# EAGLE design SpineAlignPCB (1) (EAGLE 9.7.0)
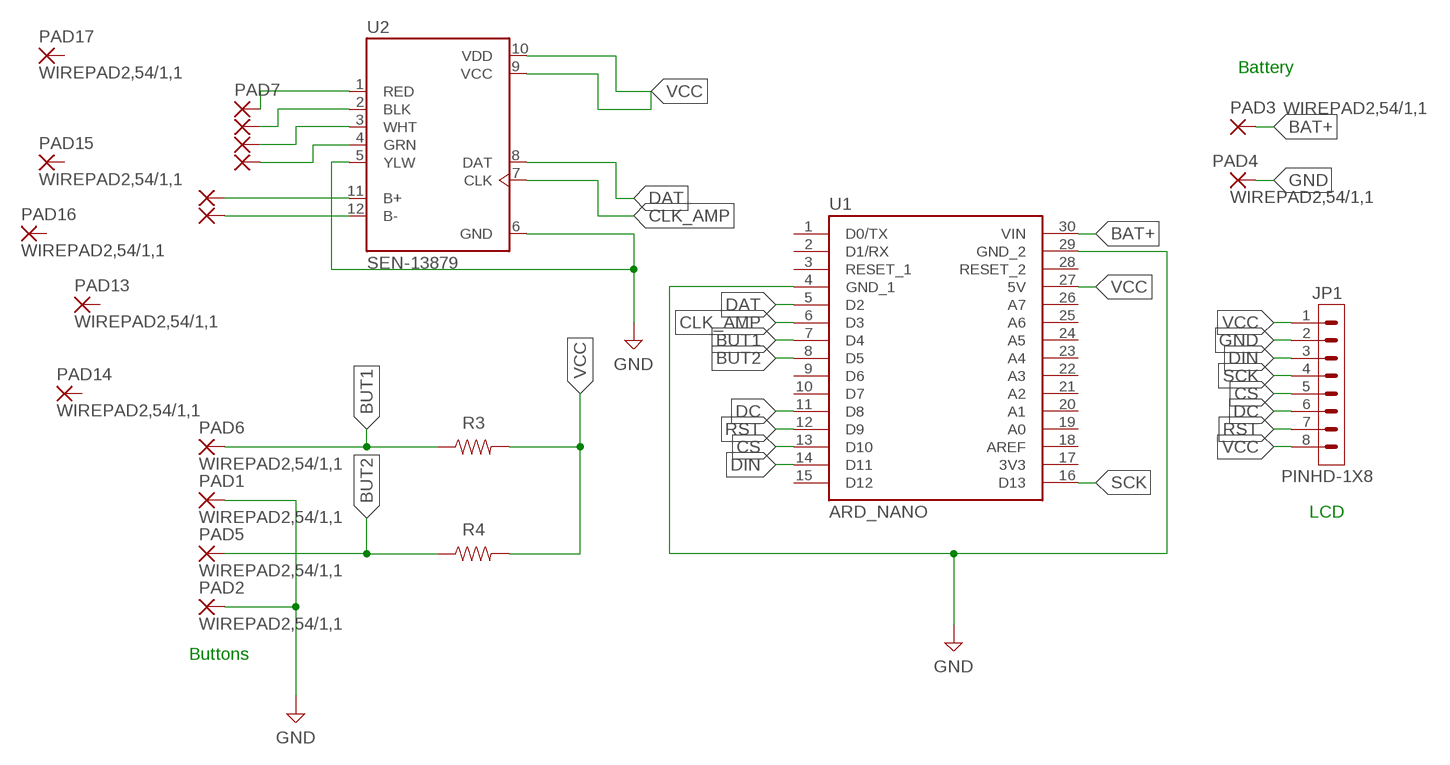
[diagram p0: schematic, sheet 1]

## Parts
JP1  PINHD-1X8  [1X08]
PAD1  WIREPAD2,54/1,1  [2,54/1,1]
PAD2  WIREPAD2,54/1,1  [2,54/1,1]
PAD3  WIREPAD2,54/1,1  [2,54/1,1]
PAD4  WIREPAD2,54/1,1  [2,54/1,1]
PAD5  WIREPAD2,54/1,1  [2,54/1,1]
PAD6  WIREPAD2,54/1,1  [2,54/1,1]
PAD7  WIREPAD2,54/1,1  [2,54/1,1]
PAD8  WIREPAD2,54/1,1  [2,54/1,1]
PAD9  WIREPAD2,54/1,1  [2,54/1,1]
PAD10  WIREPAD2,54/1,1  [2,54/1,1]
PAD11  WIREPAD2,54/1,1  [2,54/1,1]
PAD12  WIREPAD2,54/1,1  [2,54/1,1]
PAD13  WIREPAD2,54/1,1  [2,54/1,1]
PAD14  WIREPAD2,54/1,1  [2,54/1,1]
PAD15  WIREPAD2,54/1,1  [2,54/1,1]
PAD16  WIREPAD2,54/1,1  [2,54/1,1]
PAD17  WIREPAD2,54/1,1  [2,54/1,1]
R3  R-US_AXIAL-11.7MM-PITCH  [RESAD1176W63L850D250B]
R4  R-US_AXIAL-11.7MM-PITCH  [RESAD1176W63L850D250B]
U1  ARD_NANO  [MODULE_A000005]
U2  SEN-13879  [SPARKFUN_SEN-13879]

## Nets
BAT+: PAD3.1(P) U1.30(VIN)
BUT1: PAD6.1(P) R3.1 U1.7(D4)
BUT2: PAD5.1(P) R4.1 U1.8(D5)
CLK_AMP: U1.6(D3) U2.7(CLK)
CS: JP1.5 U1.13(D10)
DAT: U1.5(D2) U2.8(DAT)
DC: JP1.6 U1.11(D8)
DIN: JP1.3 U1.14(D11)
GND: JP1.2 PAD1.1(P) PAD2.1(P) PAD4.1(P) U1.4(GND_1) U1.29(GND_2) U2.5(YLW) U2.6(GND)
N$1: PAD7.1(P) U2.1(RED)
N$2: PAD8.1(P) U2.2(BLK)
N$3: PAD9.1(P) U2.3(WHT)
N$4: PAD10.1(P) U2.4(GRN)
N$5: PAD11.1(P) U2.11(B+)
N$6: PAD12.1(P) U2.12(B-)
RST: JP1.7 U1.12(D9)
SCK: JP1.4 U1.16(D13)
VCC: JP1.1 JP1.8 R3.2 R4.2 U1.27(5V) U2.9(VCC) U2.10(VDD)
Unconnected: PAD13.1(P) PAD14.1(P) PAD15.1(P) PAD16.1(P) PAD17.1(P) U1.1(D0/TX) U1.2(D1/RX) U1.3(RESET_1) U1.9(D6) U1.10(D7) U1.15(D12) U1.18(AREF) U1.19(A0) U1.20(A1) U1.21(A2) U1.22(A3) U1.23(A4) U1.24(A5) U1.25(A6) U1.26(A7) U1.28(RESET_2)

## Notes on the sheet
- Battery
- LCD
- Buttons

## Power pins joined to a net without a drawn wire
3V3: U1.17(3V3)

## Library data of the parts
JP1 = Connector:PINHD-1X8: Pin Header; CATEGORY: Connectors; DESCRIPTION: Header-Straight-8 Position; PACKAGE_TYPE: Through Hole; PITCH: 0.100" (2.54mm); SUBCATEGORY: Headers; TYPE: Male Pins
PAD1-PAD17 = wirepad:WIREPAD: Wire PAD connect wire on PCB
R3 R4 = Resistor:R-US: Resistor Fixed - ANSI; CATEGORY: Resistors; DESCRIPTION: Axial Resistor 11.76 mm pitch 8.5 mm body length 2.5 mm body diameter; PACKAGE_SIZE: AXIAL; PACKAGE_TYPE: THT
U1 = ARDUINO NANO:ARD_NANO: CLOCK SAW OSCILLATOR SEAM7050 T&; MANUFACTURER: Arduino; MAXIMUM_PACKAGE_HEIGHT: N/A; PARTREV: 23/03/2020; STANDARD: Manufacturer Recommendations
U2 = SEN-13879:SEN-13879; CHECK_PRICES: https://www.snapeda.com/parts/SEN13879/SparkFun/view-part/?ref=eda; DESCRIPTION: HX711 Load Cell Amplifier [SparkFun Electronics] SEN-13879 HX711 Load Cell Amplifier 845156007615; DIGIKEY_PART_NUMBER: 1568-1436-ND; MF: Sparkfun Electronics; MP: SEN13879; PACKAGE: None; SNAPEDA_LINK: https://www.snapeda.com/parts/SEN13879/SparkFun/view-part/?ref=snap

## Board
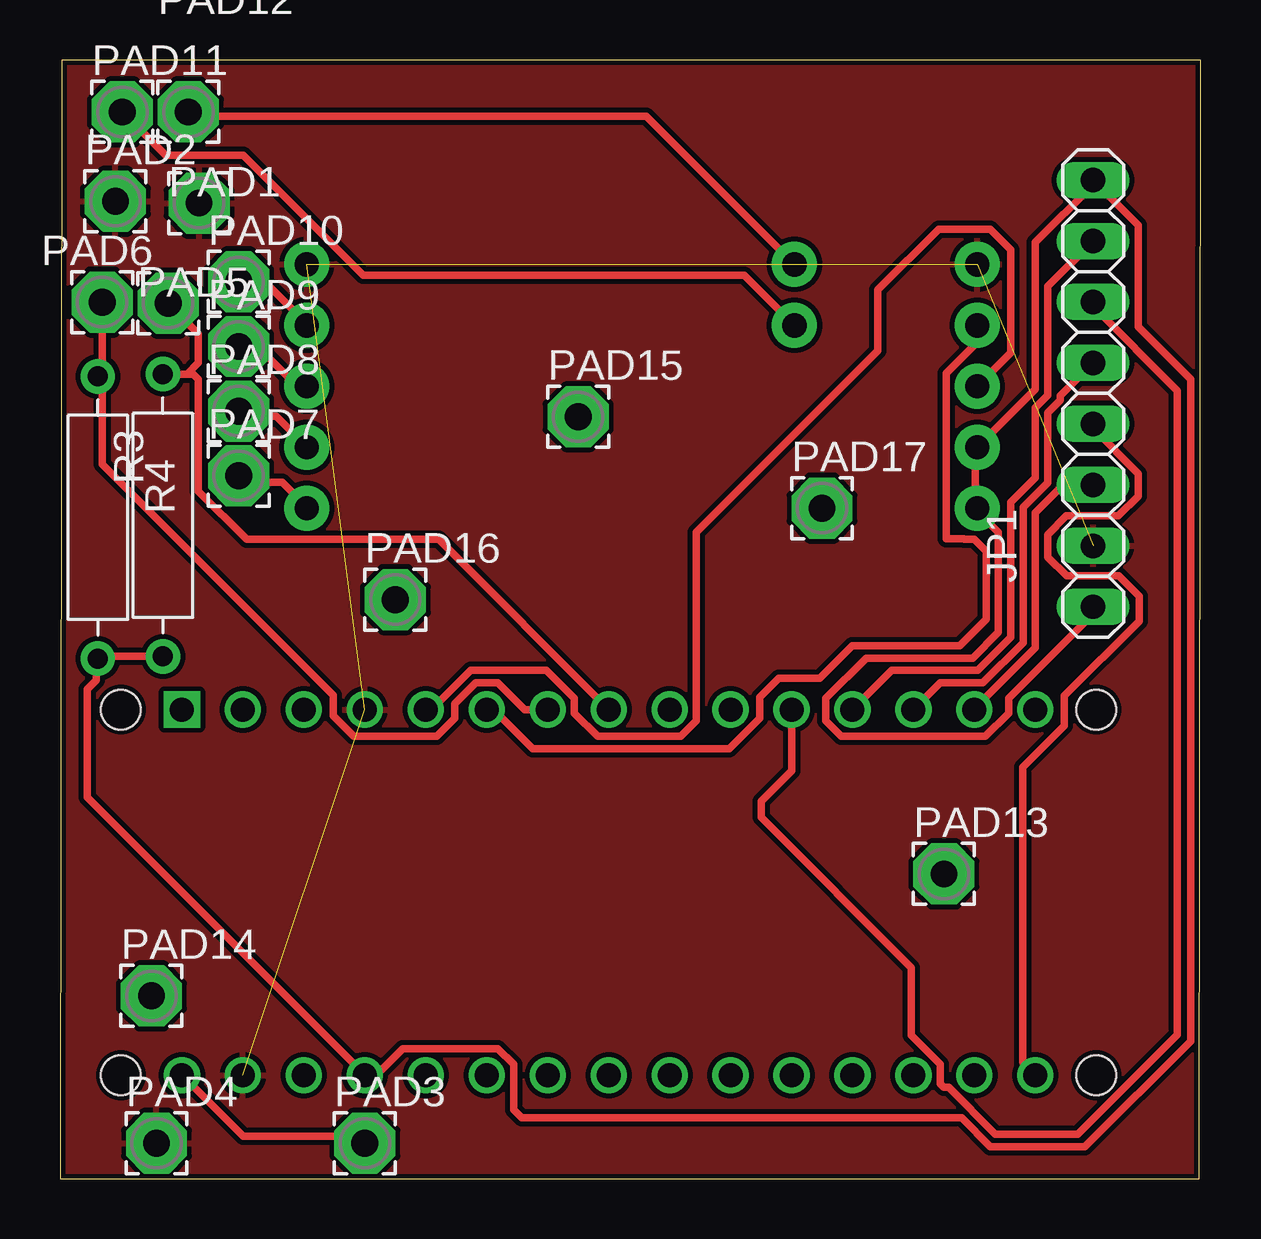
[diagram p1: board, top side]
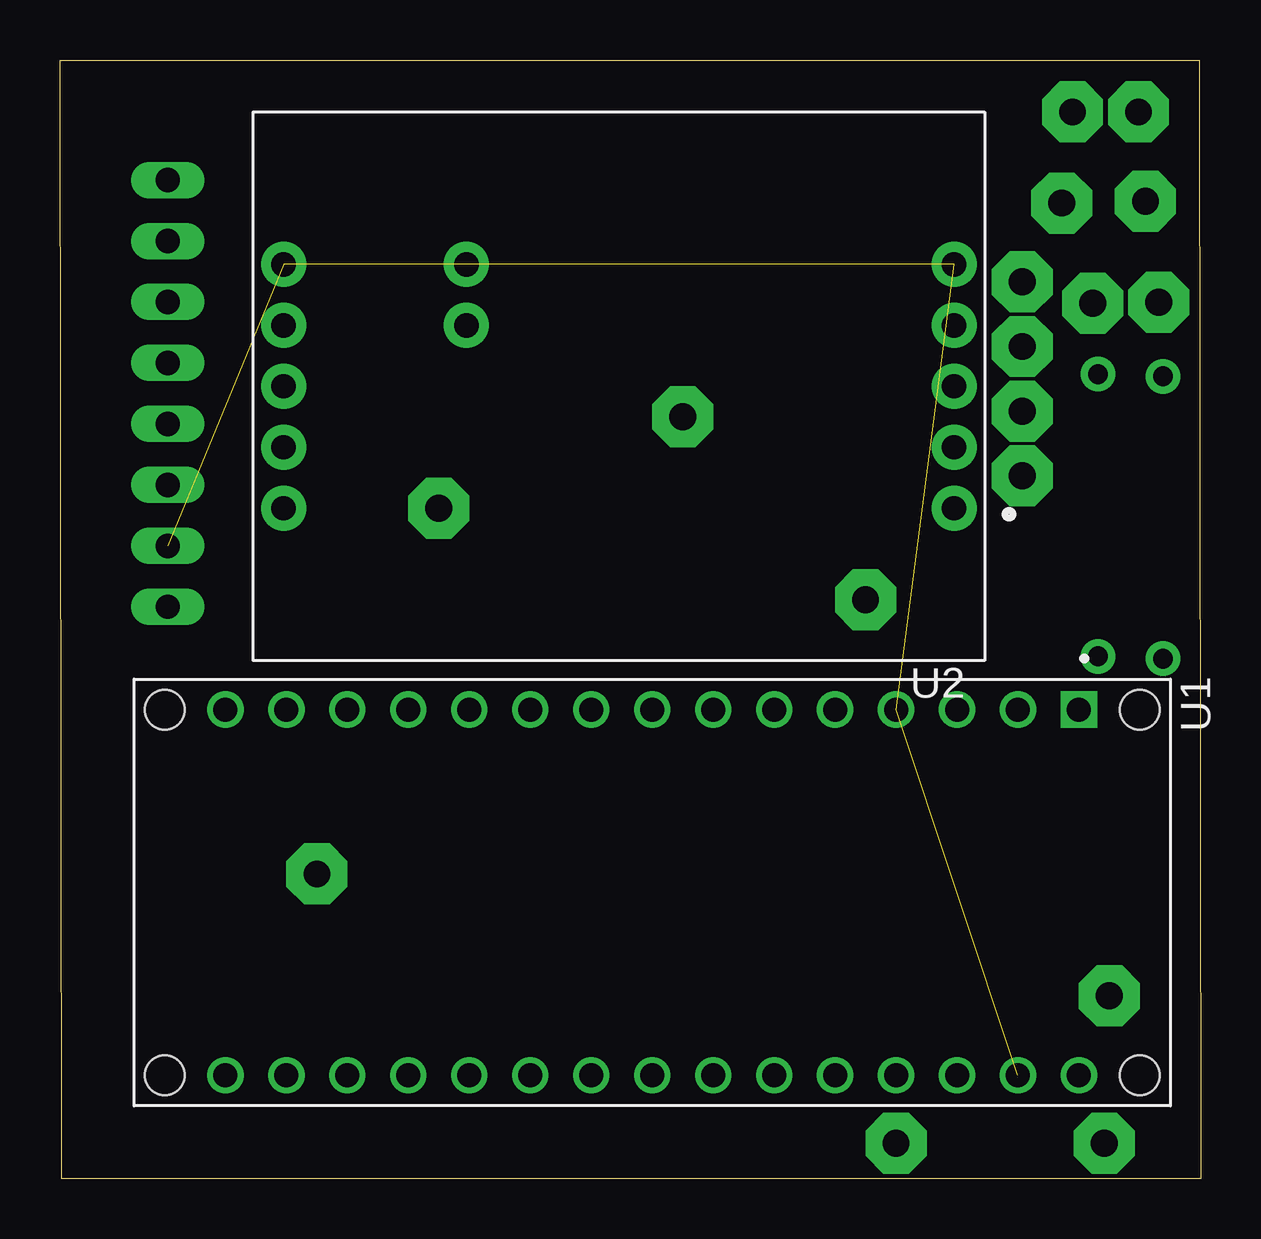
[diagram p2: board, bottom side, seen from below]

Size 47.54 x 46.61 mm. Coordinates in mm from the lower left corner, seen from the top.
Outline: 0,0 47.46,0 47.53,46.62 0.07,46.62 0,0
Copper layers (1*16): Top 0.035mm / dielectric 1.5mm / Bottom 0.035mm
Design rules "PCB Mill *": minimum track width 0.21mm, minimum drill 0.4mm, track to track 0.21mm, track to pad 0.21mm, pad to pad 0.025mm, via to via 0.21mm, smd to smd 6mil, copper to edge 0.21mm, drill to drill 0.21mm, minimum pad ring 10mil, minimum via ring 8mil, stop-mask expansion 4mil, vias tented up to drill 0mil, thermal gap 0.21mm

### Footprints (pad centres in the part's own frame; a part is rotated, then mirrored left to right if it is on the bottom)
1X08 = drill 1.016 long: 1 -8.89,0; 2 -6.35,0; 3 -3.81,0; 4 -1.27,0; 5 1.27,0; 6 3.81,0; 7 6.35,0; 8 8.89,0
2,54/1,1 = drill 1.118 pad 2.54 octagon: 1 0,0
RESAD1176W63L850D250B = drill 0.83 pad 1.43: 1 -5.88,0; 2 5.88,0
MODULE_A000005 = drill 1 square: 1 -7.62,17.78 | drill 1: 2 -7.62,15.24; 3 -7.62,12.7; 4 -7.62,10.16; 5 -7.62,7.62; 6 -7.62,5.08; 7 -7.62,2.54; 8 -7.62,0; 9 -7.62,-2.54; 10 -7.62,-5.08; 11 -7.62,-7.62; 12 -7.62,-10.16; 13 -7.62,-12.7; 14 -7.62,-15.24; 15 -7.62,-17.78; 16 7.62,-17.78; 17 7.62,-15.24; 18 7.62,-12.7; 19 7.62,-10.16; 20 7.62,-7.62; 21 7.62,-5.08; 22 7.62,-2.54; 23 7.62,0; 24 7.62,2.54; 25 7.62,5.08; 26 7.62,7.62; 27 7.62,10.16; 28 7.62,12.7; 29 7.62,15.24; 30 7.62,17.78 | hole 1.651: -7.62,-20.32; 7.62,-20.32; -7.62,20.32; 7.62,20.32
SPARKFUN_SEN-13879 = drill 1.016 pad 1.88: 1 -13.97,5.08; 2 -13.97,2.54; 3 -13.97,0; 4 -13.97,-2.54; 5 -13.97,-5.08; 6 13.97,-5.08; 7 13.97,-2.54; 8 13.97,0; 9 13.97,2.54; 10 13.97,5.08; 11 6.35,-2.54; 12 6.35,-5.08

### Placement (x,y rotation side)
JP1  43.05,32.72 90 top
PAD1  5.79,40.66 0 top
PAD2  2.31,40.73 0 top
PAD3  12.7,1.48 0 top
PAD4  4.02,1.48 0 top
PAD5  4.51,36.48 0 top
PAD6  1.76,36.52 0 top
PAD7  7.44,29.29 0 top
PAD8  7.44,31.98 0 top
PAD9  7.44,34.68 0 top
PAD10  7.44,37.37 0 top
PAD11  2.6,44.45 0 top
PAD12  5.35,44.45 0 top
PAD13  36.83,12.7 0 top
PAD14  3.81,7.62 0 top
PAD15  21.59,31.75 0 top
PAD16  13.97,24.13 0 top
PAD17  31.75,27.94 0 top
R3  1.58,27.55 270 top
R4  4.29,27.65 270 top
U1  22.86,11.93 270 bottom
U2  24.25,33.02 180 bottom

### Tracks (layer width: path | path; a pad name or v marks a point on that pad's centre or on a via)
BAT+
  Top 0.305: U1.30 5.12,4.27 7.62,1.77 12.63,1.77 PAD3.1
BUT1
  Top 0.305: PAD6.1 1.75,33.65 1.62,33.52 R3.1 1.75,33.26 1.75,29.77 11.38,20.14 11.38,19.3 12.24,18.43 15.7,18.43 16.45,19.18 16.45,19.8 17.32,20.67 18.24,20.67 19.36,19.55 U1.7
BUT2
  Top 0.305: PAD5.1 5.77,35.22 5.77,34 5.29,33.53 R4.1 5.56,33.53 5.77,33.31 5.77,28.66 7.79,26.64 15.77,26.64 U1.8
CLK_AMP
  Top 0.305: U1.6 18.07,19.55 19.7,17.92 27.89,17.92 29.16,19.2 29.16,20.07 29.95,20.85 31.66,20.85 33.02,22.21 37.48,22.21 38.59,23.32 38.59,26.15 38.1,26.64 37.68,26.64 37.65,26.67 36.92,26.67 36.92,33.56 38.22,34.86 U2.7
CS
  Top 0.305: U1.13 36.68,20.67 38.45,20.67 40.13,22.34 40.13,27.97 41.16,29 41.16,31.92 41.67,32.43 41.67,32.62 JP1.5
DAT
  Top 0.305: U2.8 39.62,34.42 39.62,38.71 38.76,39.57 36.61,39.57 34.08,37.04 34.08,34.5 26.52,26.93 26.52,19.09 25.86,18.43 22.4,18.43 21.44,19.39 21.44,20.01 20.27,21.18 17.1,21.18 15.47,19.55 U1.5
DC
  Top 0.305: U1.11 30.48,17.01 30.48,17 29.21,15.73 29.21,15.06 35.47,8.8 35.47,5.98 36.68,4.77 36.68,3.96 36.83,3.81 37.02,3.81 38.98,1.85 42.4,1.85 46.56,6.01 46.56,32.83 43.05,36.34 JP1.6
DIN
  Top 0.305: JP1.3 41.8,28.91 40.65,27.76 40.65,22.13 38.1,19.59 U1.14
GND  (4 unrouted)
  pour Top: -2.46,-0.02 -2.48,-0.04 -4.97,-2.54 -1.24,-6.27 49.5,-6.27 51.99,-3.78 51.99,51.99 -1.22,51.99 -2.46,49.51
N$1
  Top 0.305: U2.1 10.25,28.02 9.25,29.02 7.5,29.02 7.5,29.27 PAD7.1
N$2
  Top 0.305: U2.2 10.25,30.52 9,31.77 7.5,31.77 7.5,31.89 PAD8.1
N$3
  Top 0.305: U2.3 9.5,33.02 9.5,33.4 8.25,34.65 7.5,34.65 PAD9.1
N$4
  Top 0.305: U2.4 10.25,35.65 8.62,37.27 7.5,37.27 PAD10.1
N$5
  Top 0.305: U2.11 28.52,37.65 12.62,37.65 7.62,42.65 4.4,42.65 PAD11.1
N$6
  Top 0.305: PAD12.1 5.53,44.27 24.43,44.27 U2.12
RST
  Top 0.305: U1.12 34.65,21.18 38.24,21.18 39.62,22.56 39.62,28.19 40.65,29.22 40.65,32.13 41.16,32.65 41.16,37.19 JP1.7
SCK
  Top 0.305: U1.16 40.1,4.85 40.1,17.14 41.85,18.88 41.85,20.13 44.96,23.23 44.96,24.27 44.11,25.12 41.94,25.12 41.16,25.91 41.16,26.84 41.94,27.61 44.1,27.61 44.93,28.45 44.93,29.38 43.05,31.26 JP1.4
VCC
  Top 0.305: R4.2 4.25,21.77 1.62,21.77 R3.2 1.5,21.64 1.5,20.77 1.12,20.39 1.12,15.89 12.62,4.39 U1.27 12.75,4.39 13.25,4.39 14.28,5.43 18.24,5.43 18.9,4.77 18.9,2.88 19.24,2.54 37.56,2.54 38.77,1.34 42.7,1.34 47.1,5.74 47.1,33.32 44.93,35.49 44.93,39.73 JP1.8 43.05,41.42 40.65,39.02 40.65,32.91 U2.9 38.12,30.39 38.12,28.02 U2.10 | 38.12,27.39 38.12,27.89 U2.10 | JP1.1 43.05,23.54 39.52,20.01 39.52,19.39 38.56,18.43 32.56,18.43 31.9,19.09 31.9,20.01 33.59,21.7 38.03,21.7 39.1,22.77 39.1,26.94 38.22,27.82 U2.10